# EAGLE design OLED-Sensor Long Link (EAGLE 9.6.1)
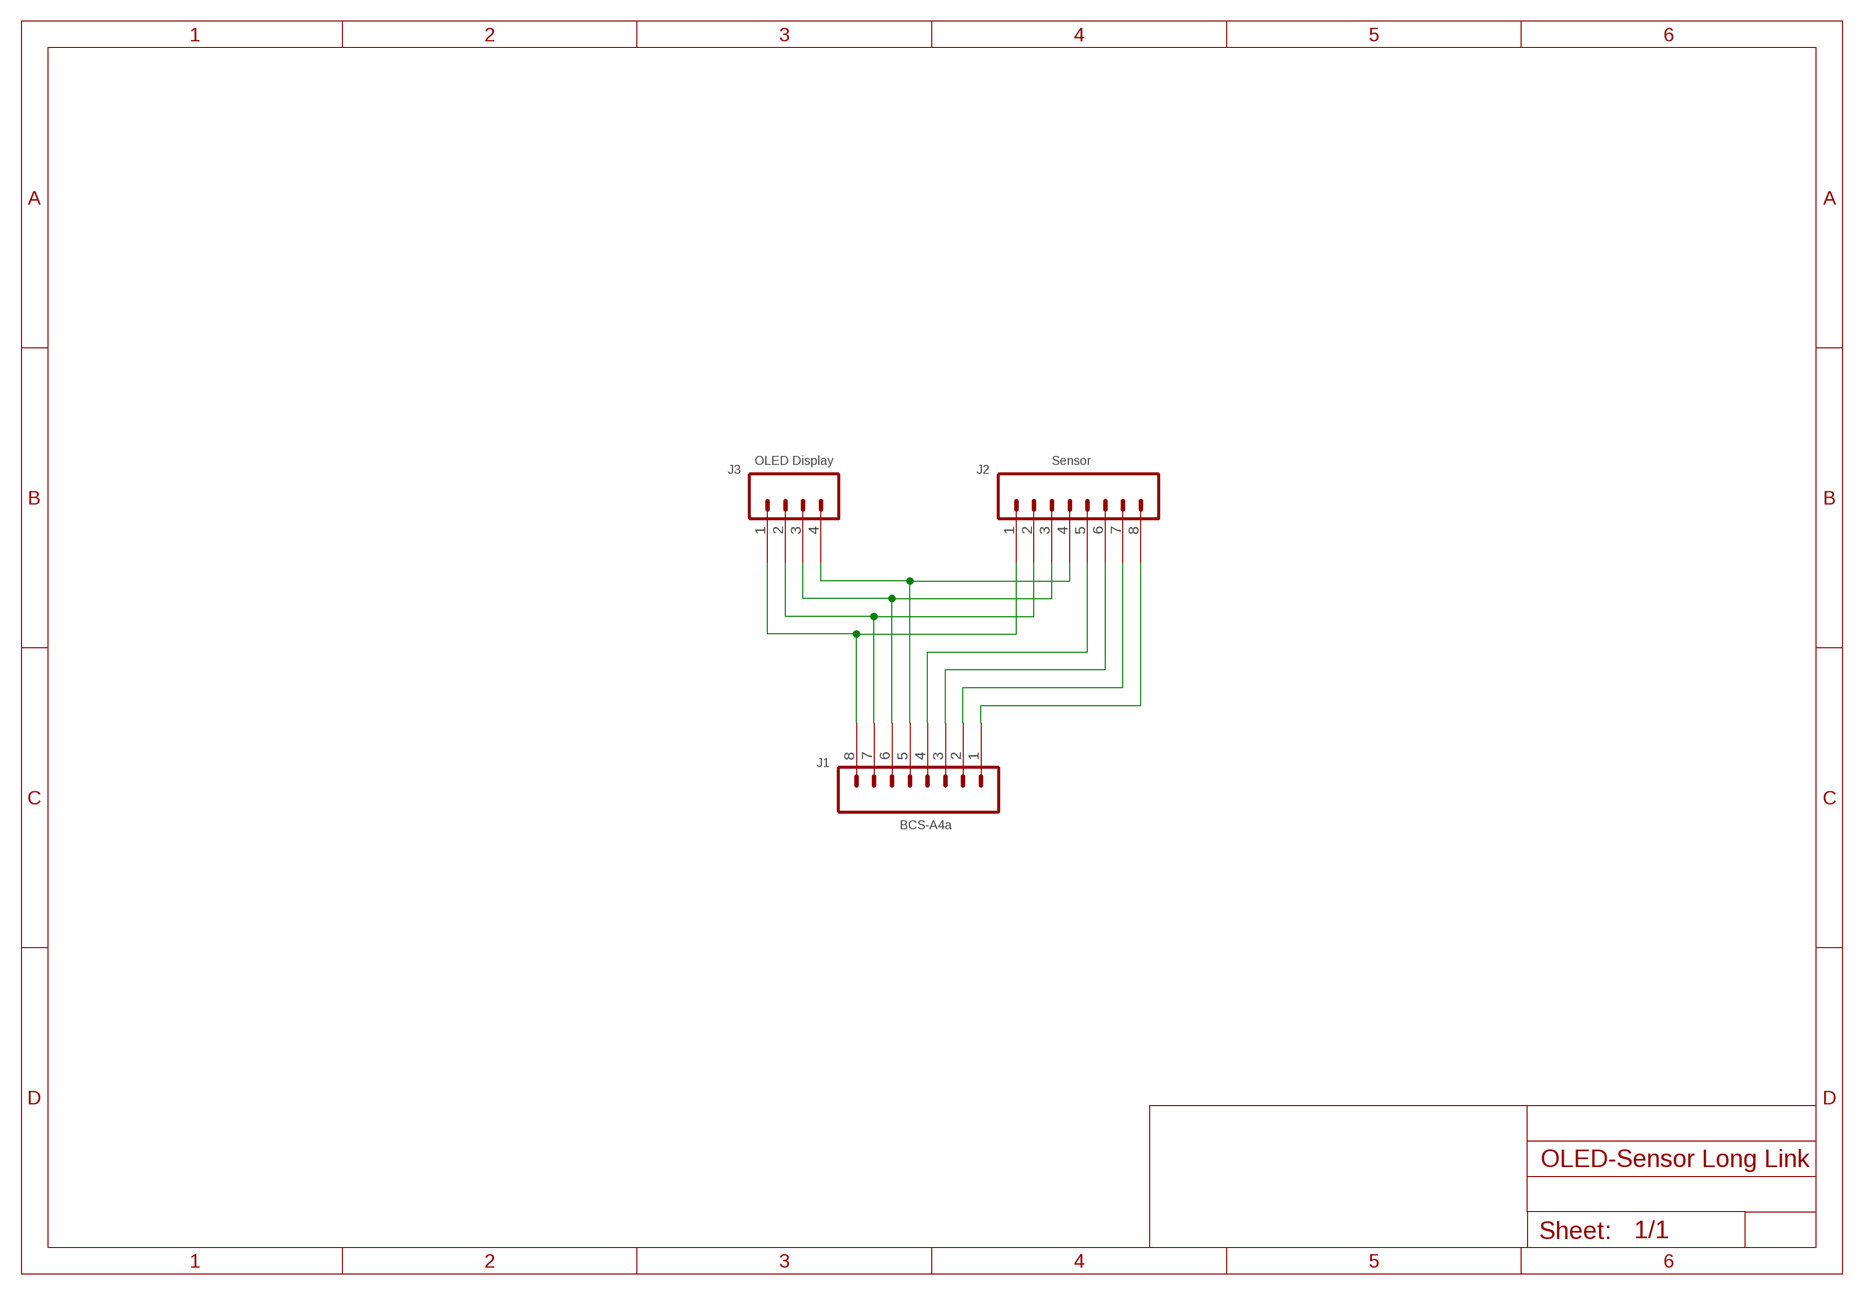
[diagram p0: schematic, sheet 1]

## Parts
J1  BCS-A4a  HEADER-1X8-GENERIC  [CONN_08-GENERIC]
J2  Sensor  HEADER-1X8-GENERIC  [CONN_08-GENERIC]
J3  OLED Display  HEADER-1X4-GENERIC  [CONN_04-GENERIC]

## Nets
N$1: J1.8 J2.1 J3.1
N$2: J1.7 J2.2 J3.2
N$3: J1.6 J2.3 J3.3
N$4: J1.5 J2.4 J3.4
N$5: J1.4 J2.5
N$6: J1.3 J2.6
N$7: J1.2 J2.7
N$8: J1.1 J2.8

## Library data of the parts
J1 J2 = digitalconcepts:HEADER-1X8-GENERIC: Single Row 8-Pin Header
J3 = digitalconcepts:HEADER-1X4-GENERIC: Single Row 4-Pin Header

## Board
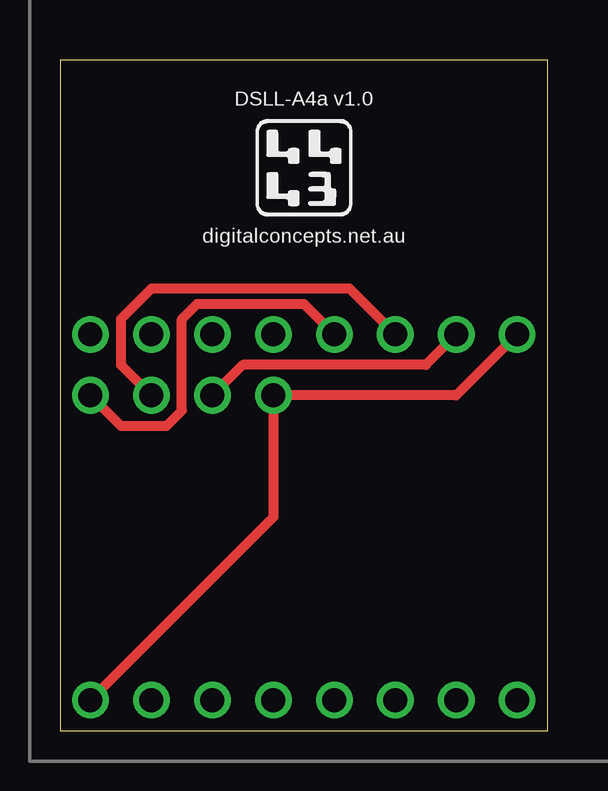
[diagram p1: board, top side]
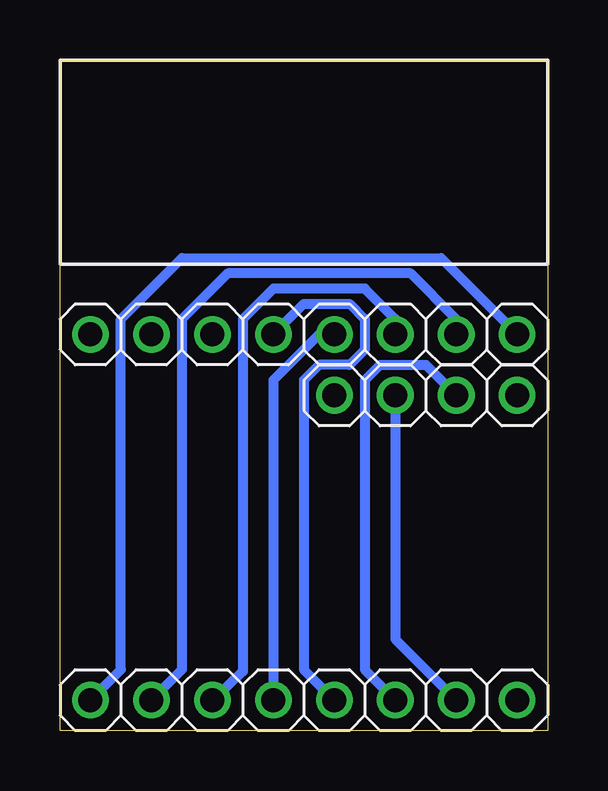
[diagram p2: board, bottom side, seen from below]

Size 20.32 x 27.94 mm. Coordinates in mm from the lower left corner, seen from the top.
Outline: 0,0 20.32,0 20.32,27.94 0,27.94 0,0
Copper layers (1*16): Top 0.035mm / dielectric 1.5mm / Bottom 0.035mm
Design rules "default *": minimum track width 6mil, minimum drill 0.35mm, track to track 6mil, track to pad 6mil, pad to pad 6mil, via to via 6mil, smd to smd 6mil, copper to edge 15mil, drill to drill 6mil, minimum pad ring 10mil, minimum via ring 8mil, stop-mask expansion 4mil, vias tented up to drill 0mil, thermal gap 10mil

### Footprints (pad centres in the part's own frame; a part is rotated, then mirrored left to right if it is on the bottom)
CONN_08-GENERIC = drill 1 pad 1.524: 1 0,0; 2 2.54,0; 3 5.08,0; 4 7.62,0; 5 10.16,0; 6 12.7,0; 7 15.24,0; 8 17.78,0
CONN_04-GENERIC = drill 1 pad 1.524: 1 0,0; 2 2.54,0; 3 5.08,0; 4 7.62,0

### Placement (x,y rotation side)
J1  19.05,1.27 0 bottom
J2  19.05,16.51 0 bottom
J3  8.89,13.97 0 bottom

### Tracks (layer width: path | path; a pad name or v marks a point on that pad's centre or on a via)
N$1
  Top 0.406: J2.1 16.51,13.97 J3.1 8.89,8.89 J1.8
N$2
  Top 0.406: J3.2 7.62,15.24 15.24,15.24 J2.2
  Bottom 0.406: J3.2 6.35,3.81 J1.7
N$3
  Top 0.406: J2.3 12.07,18.41 3.81,18.41 2.54,17.14 2.54,15.24 J3.3
  Bottom 0.406: J1.6 7.62,2.54 7.62,14.61 6.99,15.24 5.08,15.24 J3.3
N$4
  Top 0.406: J2.4 10.16,17.78 5.71,17.78 5.08,17.14 5.08,13.34 4.45,12.7 2.54,12.7 J3.4
  Bottom 0.406: J1.5 10.16,2.54 10.16,14.61 9.53,15.24 8.26,15.24 7.62,15.88 7.62,17.14 8.26,17.78 10.16,17.78 J2.4
N$5
  Bottom 0.406: J2.5 9.53,16.51 11.43,14.61 J1.4
N$6
  Bottom 0.406: J2.6 6.35,17.14 7.62,18.41 11.43,18.41 12.7,17.14 12.7,2.47 13.95,1.27 J1.3
N$7
  Bottom 0.406: J1.2 15.24,2.54 15.24,17.14 13.34,19.05 5.71,19.05 3.81,17.14 J2.7
N$8
  Bottom 0.406: J1.1 17.78,2.54 17.78,17.14 15.24,19.68 4.45,19.68 J2.8

### Text on the board
tPlace: DSLL-A4a v1.0 | digitalconcepts.net.au